# Altium project switch_rx.PrjPcb
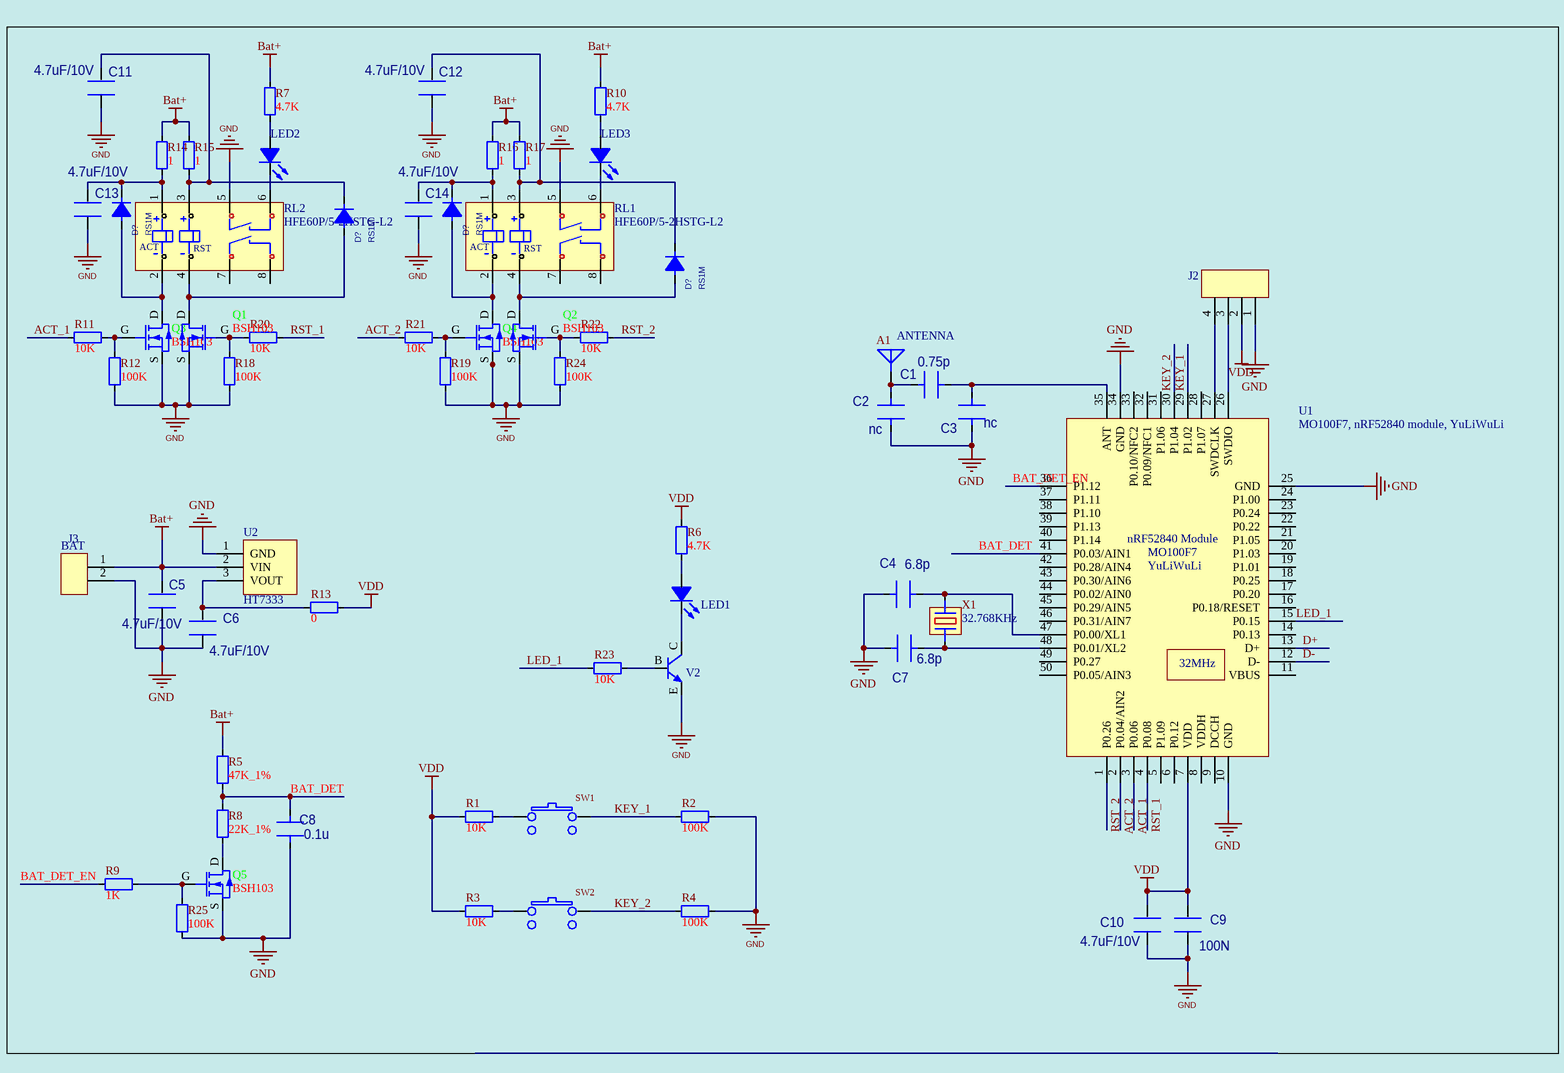
[diagram p0: switch_rx.SchDoc]
1 sheet, 62 parts. Net scope: global (net labels, ports and power ports of the same name join across sheets).
Board file: switch_rx.PcbDoc

## Sheet switch_rx.SchDoc
size A4; PageSetup: Record=PageOptions|CenterHorizontal=True|CenterVertical=True|PrintScale=1.39|XCorrection=1.00|YCorrection=1.00|PrintKind=1|BorderSize=5000000|LeftOffset=0|BottomOffset=0|Orientation=2|PaperLength=1000|PaperWidth=1000|Scale=100|PaperSource=15|PrintQuality=600|MediaType=1|DitherType=10|PrintScaleMode=1|PaperKind=A3|PaperIndex=8; Total Page: 1/1

### Parts
(Parts that share a designator on the sheet are numbered #1, #2 ... from top to bottom, then left to right.)
A1  ANTENNA  [AN2]
C1  value 0.75p  [cap0603(1608)]  (hidden comment: CAP)
C2  value nc  [cap0603(1608)]  (hidden comment: CAP)
C3  value nc  [cap0603(1608)]  (hidden comment: CAP)
C4  value 6.8p  [cap0603(1608)]  (hidden comment: CAP)
C5  value 4.7uF/10V  [cap0603(1608)]  (hidden comment: CC103)
C6  value 4.7uF/10V  [cap0603(1608)]  (hidden comment: CC103)
C7  value 6.8p  [cap0603(1608)]  (hidden comment: CAP)
C8  value 0.1u  [cap0603(1608)]  (hidden comment: CAP)
C9  value 100N  [cap0603(1608)]  (hidden comment: CC103)
C10  value 4.7uF/10V  [cap0603(1608)]  (hidden comment: CC103)
C11  value 4.7uF/10V  [cap0603(1608)]  (hidden comment: CC103)
C12  value 4.7uF/10V  [cap0603(1608)]  (hidden comment: CC103)
C13  value 4.7uF/10V  [cap0603(1608)]  (hidden comment: CC103)
C14  value 4.7uF/10V  [cap0603(1608)]  (hidden comment: CC103)
D?#1  RS1M
D?#2  RS1M
D?#3  RS1M
D?#4  RS1M
J2  HEAD-1x4  [HEAD-1x4-2.54]  (value not drawn)
J3  BAT  [HEAD-1x2-2.54]
LED1  LED  [led_3mm]  (value not drawn)
LED2  LED  [led_3mm]  (value not drawn)
LED3  LED  [led_3mm]  (value not drawn)
Q1  BSH103  [SOT-23-mosfet]
Q2  BSH103  [SOT-23-mosfet]
Q3  BSH103  [SOT-23-mosfet]
Q4  BSH103  [SOT-23-mosfet]
Q5  BSH103  [SOT-23-mosfet]
R1  10K  [RESC0603(1608)_N]
R2  100K  [RESC0603(1608)_N]
R3  10K  [RESC0603(1608)_N]
R4  100K  [RESC0603(1608)_N]
R5  47K_1%  [RESC0603(1608)_N]
R6  4.7K  [RESC0603(1608)_N]
R7  4.7K  [RESC0603(1608)_N]
R8  22K_1%  [RESC0603(1608)_N]
R9  1K  [RESC0603(1608)_N]
R10  4.7K  [RESC0603(1608)_N]
R11  10K  [RESC0603(1608)_N]
R12  100K  [RESC0603(1608)_N]
R13  0  [RESC0603(1608)_N]
R14  1  [RESC0603(1608)_N]
R15  1  [RESC0603(1608)_N]
R16  1  [RESC0603(1608)_N]
R17  1  [RESC0603(1608)_N]
R18  100K  [RESC0603(1608)_N]
R19  100K  [RESC0603(1608)_N]
R20  10K  [RESC0603(1608)_N]
R21  10K  [RESC0603(1608)_N]
R22  10K  [RESC0603(1608)_N]
R23  10K  [RESC0603(1608)_N]
R24  100K  [RESC0603(1608)_N]
R25  100K  [RESC0603(1608)_N]
RL1  HFE60P/5-2HSTG-L2  [HFE60]
RL2  HFE60P/5-2HSTG-L2  [HFE60]
SW1  TACT  [SW_6X6X5mm]  (value not drawn)
SW2  TACT  [SW_6X6X5mm]  (value not drawn)
U1  MO100F7, nRF52840 module, YuLiWuLi  [MO100F7]
U2  HT7333  [HT7333-SOT-89]
V2  NPN  [SOT-23-NPN]  (value not drawn)
X1  32.768KHz  [32.768_A]

### Nets
Bat+: C5.1 J3.1 R5.1 R7.2 R10.2 R14.2 R15.2 R16.2 R17.2 U2.2(VIN)
GND: C2.1 C3.2 C4.1 C5.2 C6.2 C7.1 C8.1 C9.2 C10.2 C11.2 C12.2 C13.2 C14.2 J2.1 J3.2 Q1.S Q2.S Q3.S Q4.S Q5.S R2.1 R4.2 R12.1 R18.1 R19.1 R24.1 R25.1 RL1.5(H1_1) RL2.5(H1_1) U1.10(GND) U1.25(GND) U1.34(GND) U2.1(GND) V2.E
VDD: C9.1 C10.1 J2.2 R1.2 R3.2 R6.2 R13.1 U1.7(VDD)
ACT_1: R11.1 U1.3(P0.06)
ACT_2: R21.1 U1.2(P0.04/AIN2)
BAT_DET: C8.2 R5.2 R8.2 U1.41(P0.03/AIN1)
BAT_DET_EN: R9.2 U1.36(P1.12)
D+: U1.13(D+)
D-: U1.12(D-)
KEY_1: R2.2 SW1.1 U1.29(P1.02)
KEY_2: R4.1 SW2.1 U1.30(P1.04)
LED_1: R23.1 U1.15(P0.15)
RST_1: R20.1 U1.4(P0.08)
RST_2: R22.1 U1.1(P0.26)
NetA1_1: A1.1(A) C1.1 C2.2
NetC1_2: C1.2 C3.1 U1.35(ANT)
NetC4_2: C4.2 U1.47(P0.00/XL1) X1.2(OUT)
NetC6_1: C6.1 R13.2 U2.3(VOUT)
NetC7_2: C7.2 U1.48(P0.01/XL2) X1.1(IN)
NetC11_1: C11.1 D?#3.2(K) R15.1 RL2.3(RST+)
NetC12_1: C12.1 D?#4.2(K) R17.1 RL1.3(RST+)
NetC13_1: C13.1 D?#1.2(K) R14.1 RL2.1(ACT+)
NetC14_1: C14.1 D?#2.2(K) R16.1 RL1.1(ACT+)
NetD?#1_1: D?#1.1(A) Q3.D RL2.2(ACT-)
NetD?#2_1: D?#2.1(A) Q4.D RL1.2(ACT-)
NetD?#3_1: D?#3.1(A) Q1.D RL2.4(RST-)
NetD?#4_1: D?#4.1(A) Q2.D RL1.4(RST-)
NetJ2_3: J2.3 U1.26(SWDIO)
NetJ2_4: J2.4 U1.27(SWDCLK)
NetLED1_1: LED1.1(A) R6.1
NetLED1_2: LED1.2(K) V2.C
NetLED2_1: LED2.1(A) R7.1
NetLED2_2: LED2.2(K) RL2.6(H1_2)
NetLED3_1: LED3.1(A) R10.1
NetLED3_2: LED3.2(K) RL1.6(H1_2)
NetQ1_G: Q1.G R18.2 R20.2
NetQ2_G: Q2.G R22.2 R24.2
NetQ3_G: Q3.G R11.2 R12.2
NetQ4_G: Q4.G R19.2 R21.2
NetQ5_D: Q5.D R8.1
NetQ5_G: Q5.G R9.1 R25.2
NetR1_1: R1.1 SW1.2
NetR3_1: R3.1 SW2.2
NetR23_2: R23.2 V2.B

Not connected (* = marked no-connect by the designer): RL1 7(H2_1) 8(H2_2); RL2 7(H2_1) 8(H2_2); U1 5(P1.09) 6(P0.12) 8(VDDH) 9(DCCH) 11(VBUS) 14(P0.13) 16(P0.18/RESET) 17(P0.20) 18(P0.25) 19(P1.01) 20(P1.03) 21(P1.05) 22(P0.22) 23(P0.24) 24(P1.00) 28(P1.07) 31(P1.06) 32(P0.09/NFC1) 33(P0.10/NFC2) 37(P1.11) 38(P1.10) 39(P1.13) 40(P1.14) 42(P0.28/AIN4) 43(P0.30/AIN6) 44(P0.02/AIN0) 45(P0.29/AIN5) 46(P0.31/AIN7) 49(P0.27) 50(P0.05/AIN3)

### Notes on the sheet
- (near U1) 32MHz
- Revision History List
- Date
- Revision
- 001
- New Design
- Description
- Project
- Rev
- Approval Date
- Page
- Author
- Approved By
- Document Number
- Info class:
- Strictly confidential
- Title
- Page Title
- Prototype A
- (in symbol HFE60P/5-2HSTG-L2) ACT; RST
- (in symbol MO100F7) nRF52840 Module; YuLiWuLi

### Library data of the parts
A1 = ANTENNA: PCB Antenna
C1-C4 C7 C8 = CAP: PART DESC: DECOUP CAP RADIAL BODY:.270 X.130 CENTERS:.200; PCB DECAL: CAP0603; SPICE PAR2: (C)
C5 C6 C9-C14 = CC103: PART DESC: CERAMIC CAPACITOR; PCB DECAL: CAP0603
D?#1-D?#4 = Diode: Number devices in Package: 1; OriginalSymbolOrigin: (0,0); CLASS: IC; PCB_dir: 0.000000; PCB_loc: TOP; PCB_y: 23.500000; Part Number: SEMI-0111; PCB_x: 0.000000
J3 = HEAD-1x2
Q1-Q5 = MOSFET-N: N channel MOSFET, 20V, 3.7A, 39mohm; Published: 8-Jun-2000; LatestRevisionDate: 17-Jul-2002; LatestRevisionNote: Re-released for DXP Platform.; PackageVersion: 1995/1996; Publisher: Altium Limited; PackageDescription: TO, Flat Index; 3 In-Line, Axial Leads; Body Dia. 4.6mm; Lead Dia. 0.5 mm (max); PackageReference: SOT-23-MOSFET
R1-R4 R6-R25 = Res: Value: 47K_1%; Publisher: i3tex; PackageReference: 0603; Mounting: SMD
R5 = Res: Publisher: i3tex; Value: 47K_1%; PackageReference: 0603; Mounting: SMD
SW1 SW2 = SWITCH_TACT_SPST_2-2_PINS
U1 = MO100F7
X1 = Crystal_2PIN